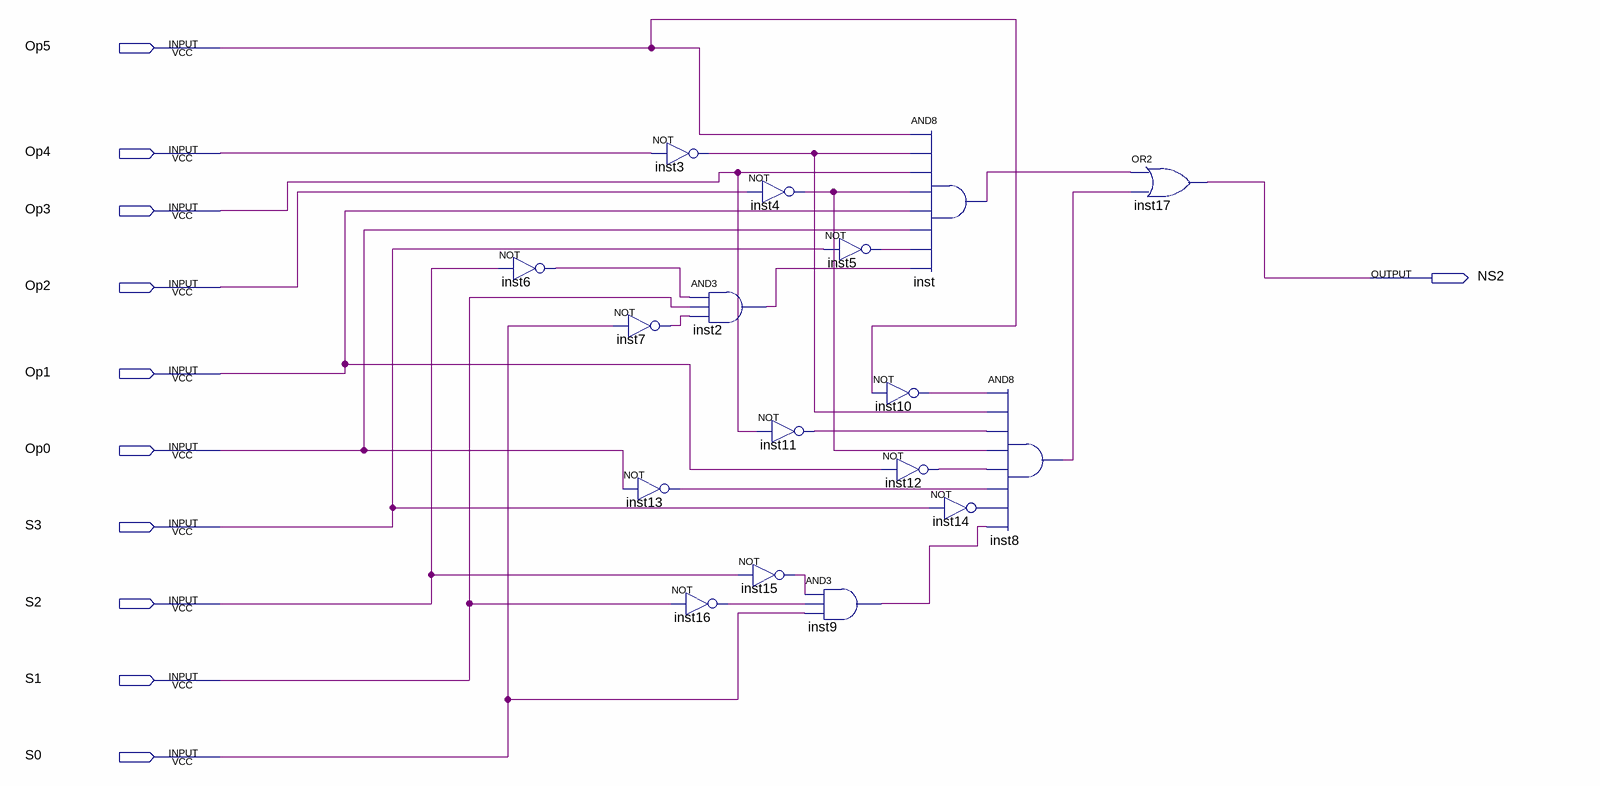
[diagram p0: schematic sheet]
// Quartus schematic NS2.bdf as structural Verilog: 17 symbols, 11 pins
module NS2 (
  input  Op5,
  input  Op4,
  input  Op3,
  input  Op2,
  input  Op1,
  input  Op0,
  input  S3,
  input  S2,
  input  S1,
  input  S0,
  output NS2
);

  wire inst2_out, inst3_out, inst4_out, inst5_out, inst6_out, inst7_out, inst8_out, inst9_out, inst10_out,
       inst11_out, inst12_out, inst13_out, inst14_out, inst15_out, inst16_out, inst_out;

  not inst6 (inst6_out, S2);
  not inst3 (inst3_out, Op4);
  not inst7 (inst7_out, S0);
  not inst13 (inst13_out, Op0);
  not inst16 (inst16_out, S1);
  not inst4 (inst4_out, Op2);
  and inst2 (inst2_out, inst6_out, S1, inst7_out);
  not inst11 (inst11_out, Op3);
  not inst15 (inst15_out, S2);
  not inst5 (inst5_out, S3);
  and inst9 (inst9_out, inst15_out, inst16_out, S0);
  and inst (inst_out, Op5, inst3_out, Op3, inst4_out, Op1, Op0, inst5_out, inst2_out);
  not inst10 (inst10_out, Op5);
  not inst12 (inst12_out, Op1);
  and inst8 (inst8_out, inst10_out, inst3_out, inst11_out, inst4_out, inst12_out, inst13_out, inst14_out, inst9_out);
  not inst14 (inst14_out, S3);
  or inst17 (NS2, inst_out, inst8_out);
endmodule
